# EasyEDA Pro project SP26_brainstim3_wholeCircuitSchematic(easyEDAPRO)_BenFerguson.epro

# Schematic Full Brain Stim
Board Name: Full Brain Stim; Create Date: 2026-04-13; Page Name: Sheet_1; Project Name: Brain Stim; Schematic Name: Full Brain Stim; Update Date: 2026-04-13; Add into BOM: yes; Company: Your Company; Convert to PCB: yes; Date: 2026-03-31; Draw By: bsferguson; REV: 1.0; Sheet: 1/1; spicePre: .
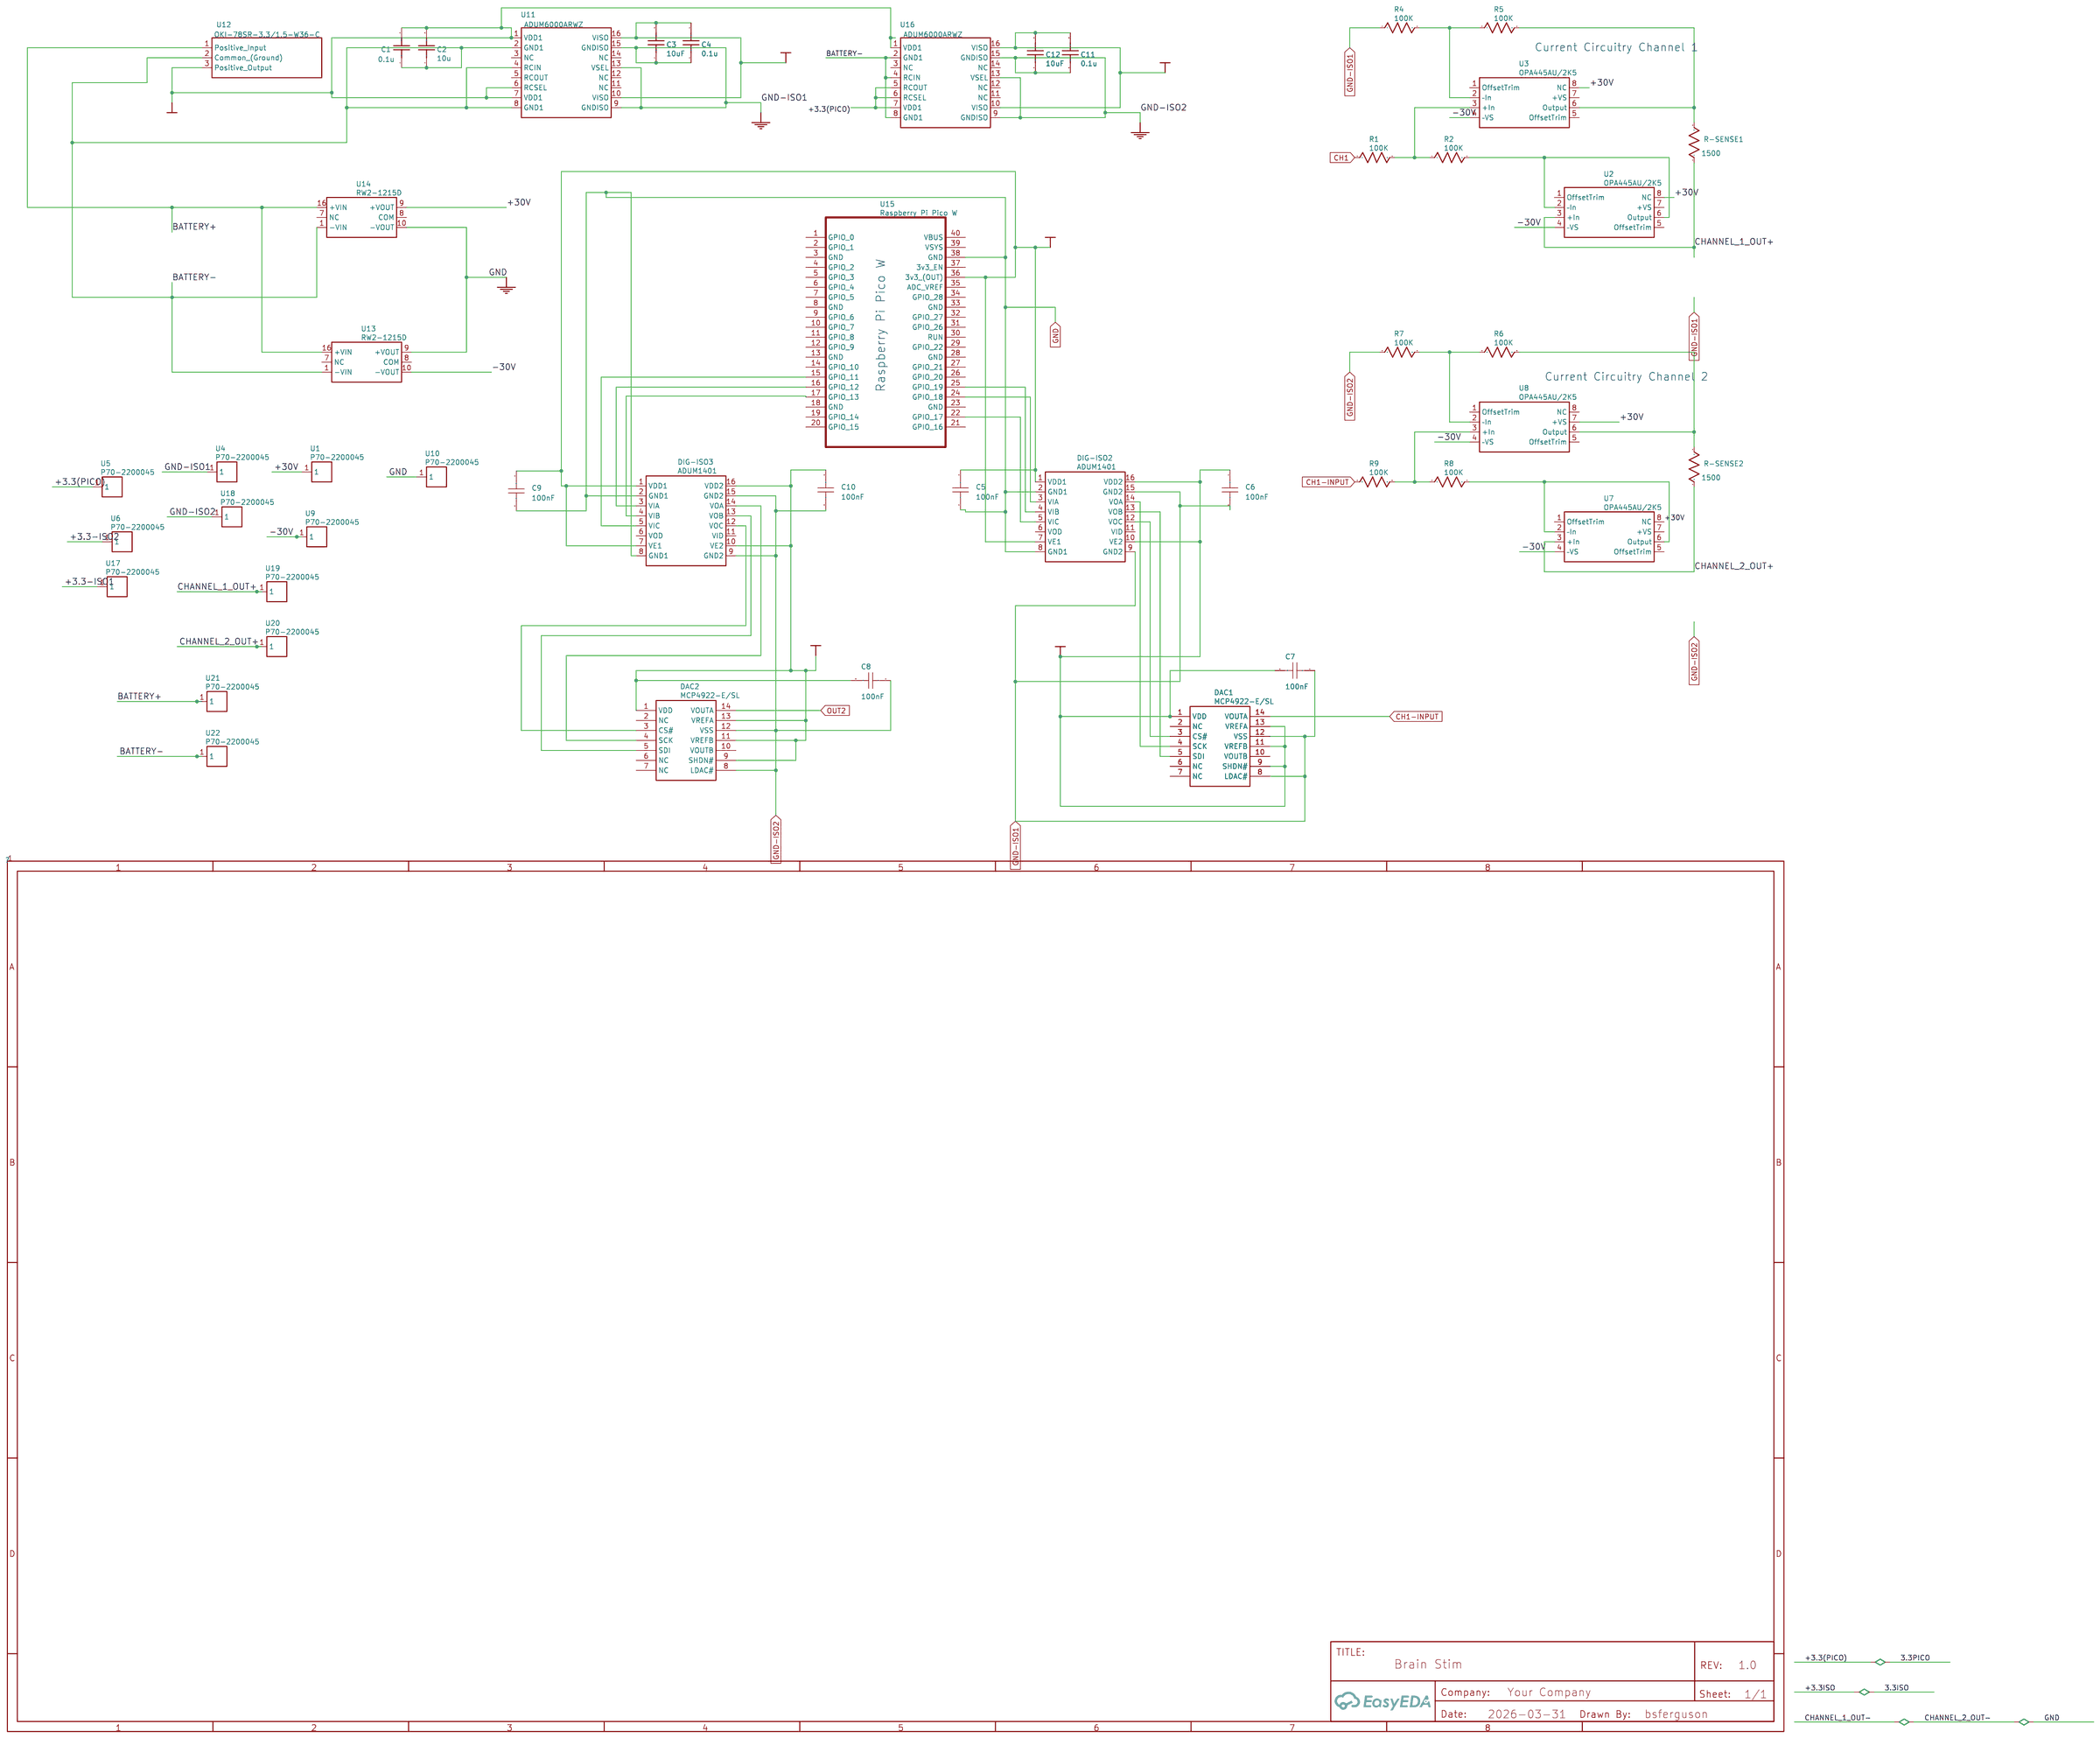
[diagram p0: schematic sheet]

## Parts
C1  0.1u  [C0603]
C2  10u  [C0603]
C3  10uF  [C0603]
C4  0.1u  [C0603]
C5  100nF  [C0603]
C6  100nF  [C0603]
C7  100nF  [C0603]
C8  100nF  [C0603]
C9  100nF  [C0603]
C10  100nF  [C0603]
C11  0.1u  [C0603]
C12  10uF  [C0603]
DAC1  MCP4922-E/SL  [SOIC-14_L8.7-W3.9-P1.27-LS6.0-BL]
DAC2  MCP4922-E/SL  [SOIC-14_L8.7-W3.9-P1.27-LS6.0-BL]
DIG-ISO2  ADUM1401  [SOIC-16_L10.3-W7.5-P1.27-LS10.3-BL]
DIG-ISO3  ADUM1401  [SOIC-16_L10.3-W7.5-P1.27-LS10.3-BL]
R1  100K  [R0603]
R2  100K  [R0603]
R4  100K  [R0603]
R5  100K  [R0603]
R6  100K  [R0603]
R7  100K  [R0603]
R8  100K  [R0603]
R9  100K  [R0603]
R-SENSE1  1500  [R0603]
R-SENSE2  1500  [R0603]
U1  P70-2200045  [TESTPOINT-TH_BD2.0-D1.0_TESTPOINT-TH_BD2.0-D1.0]
U2  OPA445AU/2K5  [SOIC-8_L4.9-W3.9-P1.27-LS6.0-BL]
U3  OPA445AU/2K5  [SOIC-8_L4.9-W3.9-P1.27-LS6.0-BL]
U4  P70-2200045  [TESTPOINT-TH_BD2.0-D1.0_TESTPOINT-TH_BD2.0-D1.0]
U5  P70-2200045  [TESTPOINT-TH_BD2.0-D1.0_TESTPOINT-TH_BD2.0-D1.0]
U6  P70-2200045  [TESTPOINT-TH_BD2.0-D1.0_TESTPOINT-TH_BD2.0-D1.0]
U7  OPA445AU/2K5  [SOIC-8_L4.9-W3.9-P1.27-LS6.0-BL]
U8  OPA445AU/2K5  [SOIC-8_L4.9-W3.9-P1.27-LS6.0-BL]
U9  P70-2200045  [TESTPOINT-TH_BD2.0-D1.0_TESTPOINT-TH_BD2.0-D1.0]
U10  P70-2200045  [TESTPOINT-TH_BD2.0-D1.0_TESTPOINT-TH_BD2.0-D1.0]
U11  ADUM6000ARWZ  [SOIC-16_L10.3-W7.4-P1.27-LS10.3-BL]
U12  OKI-78SR-3.3/1.5-W36-C  [PWRM-TH_OKI-78SR-3.3-1.5-W36-C]
U13  RW2-1215D  [PWRM-TH_RW2-XXXXX]
U14  RW2-1215D  [PWRM-TH_RW2-XXXXX]
U15  Raspberry Pi Pico W  [RASPBERRY PI PICO/ RASPBERRY PI PICO W]
U16  ADUM6000ARWZ  [SOIC-16_L10.3-W7.4-P1.27-LS10.3-BL]
U17  P70-2200045  [TESTPOINT-TH_BD2.0-D1.0_TESTPOINT-TH_BD2.0-D1.0]
U18  P70-2200045  [TESTPOINT-TH_BD2.0-D1.0_TESTPOINT-TH_BD2.0-D1.0]
U19  P70-2200045  [TESTPOINT-TH_BD2.0-D1.0_TESTPOINT-TH_BD2.0-D1.0]
U20  P70-2200045  [TESTPOINT-TH_BD2.0-D1.0_TESTPOINT-TH_BD2.0-D1.0]
U21  P70-2200045  [TESTPOINT-TH_BD2.0-D1.0_TESTPOINT-TH_BD2.0-D1.0]
U22  P70-2200045  [TESTPOINT-TH_BD2.0-D1.0_TESTPOINT-TH_BD2.0-D1.0]

## Library data of the parts
C1 C4 C11 = 0.1u: nameAlias: Value(F); Contributor: LCEDA_Lib; spicePre: C; spiceSymbolName: C_0603_US
C2 = 10u: nameAlias: Value(F); Contributor: LCEDA_Lib; spicePre: C; spiceSymbolName: C_0603_US
C3 C12 = 10uF: nameAlias: Value(F); Contributor: LCEDA_Lib; spicePre: C; spiceSymbolName: C_0603_US
C5-C10 = CAP_0603: Supplier Footprint: 0603
DAC1 DAC2 = MCP4922-E/SL: Supplier: LCSC; Manufacturer: MICROCHIP(美国微芯); Supplier Part: C39851; JLCPCB Part Class: Extended Part; Contributor: Diego Arruda da Silveira; spicePre: U
DIG-ISO2 DIG-ISO3 = ADUM1401: Supplier: LCSC; Supplier Part: C201135; Manufacturer: Analog Devices; Manufacturer Part: ADUM1401ARWZ-RL; JLCPCB Part Class: Extend; Contributor: inenarokomov; LCSC Assembly: Yes; spicePre: U; spiceSymbolName: ADUM1401ARWZ-RL
R1 R2 R4-R9 = 100K: nameAlias: Value(Ω); Contributor: LCEDA_Lib; spicePre: R; spiceSymbolName: R_0603_US
R-SENSE1 R-SENSE2 = 1500: nameAlias: Value(Ω); Contributor: LCEDA_Lib; spicePre: R; spiceSymbolName: R_0603_US
U1 U4-U6 U9 U10 U17-U22 = P70-2200045: Supplier: LCSC; Supplier Part: C21890164; Manufacturer: Harwin; JLCPCB Part Class: Extended Part; Contributor: lcsc; spicePre: U
U2 U3 U7 U8 = OPA445AU/2K5: Supplier: LCSC; Supplier Part: C1348606; Manufacturer: TI(德州仪器); JLCPCB Part Class: Extended Part; Contributor: LCSC; spicePre: U
U11 U16 = ADUM6000ARWZ: Supplier: LCSC; Supplier Part: C661383; Manufacturer: ADI(亚德诺); JLCPCB Part Class: Extended Part; Contributor: LCSC; spicePre: U
U12 = OKI-78SR-3.3/1.5-W36-C: Supplier: LCSC; Supplier Part: C9900205302; Manufacturer: null; Contributor: lcsc; spicePre: U
U13 U14 = RW2-1215D: Supplier: LCSC; Supplier Part: C6208624; Manufacturer: Recom Power; JLCPCB Part Class: Extended Part; Contributor: lcsc; spicePre: U
U15 = Raspberry Pi Pico W: Manufacturer: Raspberry Pi; Manufacturer Part: PICO W; Supplier Part: C7203003; Supplier: LCSC; Contributor: lynxaniya; spicePre: U

## Nets
+3.3V-ISO1: C6.1 C7.2 DAC1.1(VDD) DAC1.9(SHDN#) DAC1.11(VREFB) DAC1.13(VREFA) DIG-ISO2.10(VE2) DIG-ISO2.16(VDD2)
+30V: U1.1 U2.8(NC) U3.8(NC) U7.8(NC) U8.7(+VS) U14.9(+VOUT)
-30V: U2.4(–VS) U3.4(–VS) U7.4(–VS) U8.4(–VS) U9.1 U13.10(-VOUT)
GND: C5.2 C9.2 DIG-ISO2.2(GND1) DIG-ISO2.8(GND1) DIG-ISO3.2(GND1) DIG-ISO3.8(GND1) U10.1 U13.9(+VOUT) U14.10(-VOUT) U15.38(GND)
GND-ISO1: C3.1 C4.1 C6.2 C7.1 DAC1.8(LDAC#) DAC1.12(VSS) DIG-ISO2.9(GND2) DIG-ISO2.15(GND2) R4.1 U4.1 U11.9(GNDISO) U11.13(VSEL) U11.15(GNDISO)
GND-ISO2: C8.1 C10.2 C11.1 C12.1 DAC2.8(LDAC#) DAC2.12(VSS) DIG-ISO3.9(GND2) DIG-ISO3.15(GND2) R7.1 U16.9(GNDISO) U16.13(VSEL) U16.15(GNDISO) U18.1
+3.3(PICO): C1.2 C2.2 C5.1 C9.1 DIG-ISO2.1(VDD1) DIG-ISO2.7(VE1) DIG-ISO3.1(VDD1) DIG-ISO3.7(VE1) U5.1 U11.1(VDD1) U11.6(RCSEL) U11.7(VDD1) U12.3(Positive Output) U15.36(3v3 (OUT)) U16.1(VDD1) U16.5(RCOUT) U16.6(RCSEL) U16.7(VDD1)
+3.3-ISO1: C3.2 C4.2 U11.10(VISO) U11.16(VISO) U17.1
+3.3-ISO2: C11.2 C12.2 U6.1 U16.10(VISO) U16.16(VISO)
BATTERY+: U12.1(Positive Input) U13.16(+VIN) U14.16(+VIN) U21.1
BATTERY-: C1.1 C2.1 U11.2(GND1) U11.4(RCIN) U11.8(GND1) U12.2(Common (Ground)) U13.1(-VIN) U14.1(-VIN) U16.2(GND1) U16.4(RCIN) U16.8(GND1) U22.1
CH1: R1.1
CH1-INPUT: DAC1.14(VOUTA) R9.1
CHANNEL_1_OUT+: R-SENSE1.1 U2.3(+In) U19.1
CHANNEL_2_OUT+: R-SENSE2.1 U7.3(+In) U20.1
OUT2: DAC2.14(VOUTA)
$1N1: R1.2 R2.1 U3.3(+In)
$1N2: R2.2 U2.2(–In) U2.6(Output)
$1N5: R4.2 R5.1 U3.2(–In)
$1N7: R5.2 R-SENSE1.2 U3.6(Output)
$1N9: R6.2 R-SENSE2.2 U8.6(Output)
$1N11: R6.1 R7.2 U8.2(–In)
$1N13: R8.2 U7.2(–In) U7.6(Output)
$1N14: R8.1 R9.2 U8.3(+In)
$1N1782: DAC1.5(SDI) DIG-ISO2.13(VOB)
$1N1783: DIG-ISO2.4(VIB) U15.25(GPIO 19)
$1N1784: DAC1.4(SCK) DIG-ISO2.14(VOA)
$1N1785: DIG-ISO2.3(VIA) U15.24(GPIO 18)
$1N1786: DAC1.3(CS#) DIG-ISO2.12(VOC)
$1N1787: DIG-ISO2.5(VIC) U15.22(GPIO 17)
$1N1790: DIG-ISO3.3(VIA) U15.16(GPIO 12)
$1N1791: DIG-ISO3.4(VIB) U15.17(GPIO 13)
$1N1792: DAC2.4(SCK) DIG-ISO3.14(VOA)
$1N1793: DAC2.5(SDI) DIG-ISO3.13(VOB)
$1N1794: DAC2.3(CS#) DIG-ISO3.12(VOC)
$1N1795: DIG-ISO3.5(VIC) U15.15(GPIO 11)
$1N1797: C8.2 C10.1 DAC2.1(VDD) DAC2.9(SHDN#) DAC2.11(VREFB) DAC2.13(VREFA) DIG-ISO3.10(VE2) DIG-ISO3.16(VDD2)

Not connected (* = marked no-connect by the designer): DAC1 2(NC) 6(NC) 7(NC) 10(VOUTB); DAC2 2(NC) 6(NC) 7(NC) 10(VOUTB); DIG-ISO2 6(VOD) 11(VID); DIG-ISO3 6(VOD) 11(VID); U2 1(OffsetTrim) 5(OffsetTrim) 7(+VS); U3 1(OffsetTrim) 5(OffsetTrim) 7(+VS); U7 1(OffsetTrim) 5(OffsetTrim) 7(+VS); U8 1(OffsetTrim) 5(OffsetTrim) 8(NC); U11 3(NC) 5(RCOUT) 11(NC) 12(NC) 14(NC); U13 7(NC) 8(COM); U14 7(NC) 8(COM); U15 1(GPIO 0) 2(GPIO 1) 3(GND) 4(GPIO 2) 5(GPIO 3) 6(GPIO 4) 7(GPIO 5) 8(GND) 9(GPIO 6) 10(GPIO 7) 11(GPIO 8) 12(GPIO 9) 13(GND) 14(GPIO 10) 18(GND) 19(GPIO 14) 20(GPIO 15) 21(GPIO 16) 23(GND) 26(GPIO 20) 27(GPIO 21) 28(GND) 29(GPIO 22) 30(RUN) 31(GPIO 26) 32(GPIO 27) 33(GND) 34(GPIO 28) 35(ADC_VREF) 37(3v3_EN) 39(VSYS) 40(VBUS); U16 3(NC) 11(NC) 12(NC) 14(NC)

## Notes on the sheet
- Current Circuitry Channel 1
- Raspberry Pi Pico W
- Current Circuitry Channel 2

# Schematic sig gen
Board Name: sig gen; Create Date: 2026-04-07; Page Name: Sheet_1; Project Name: BackupProjects_jacksonmertes_personal_0_20260327; Schematic Name: sig gen; Update Date: 2026-04-11; Add into BOM: yes; Company: Your Company; Convert to PCB: yes; Date: 2026-03-18; Draw By: jacksonmertes; REV: 1.0; Sheet: 1/1; spicePre: .
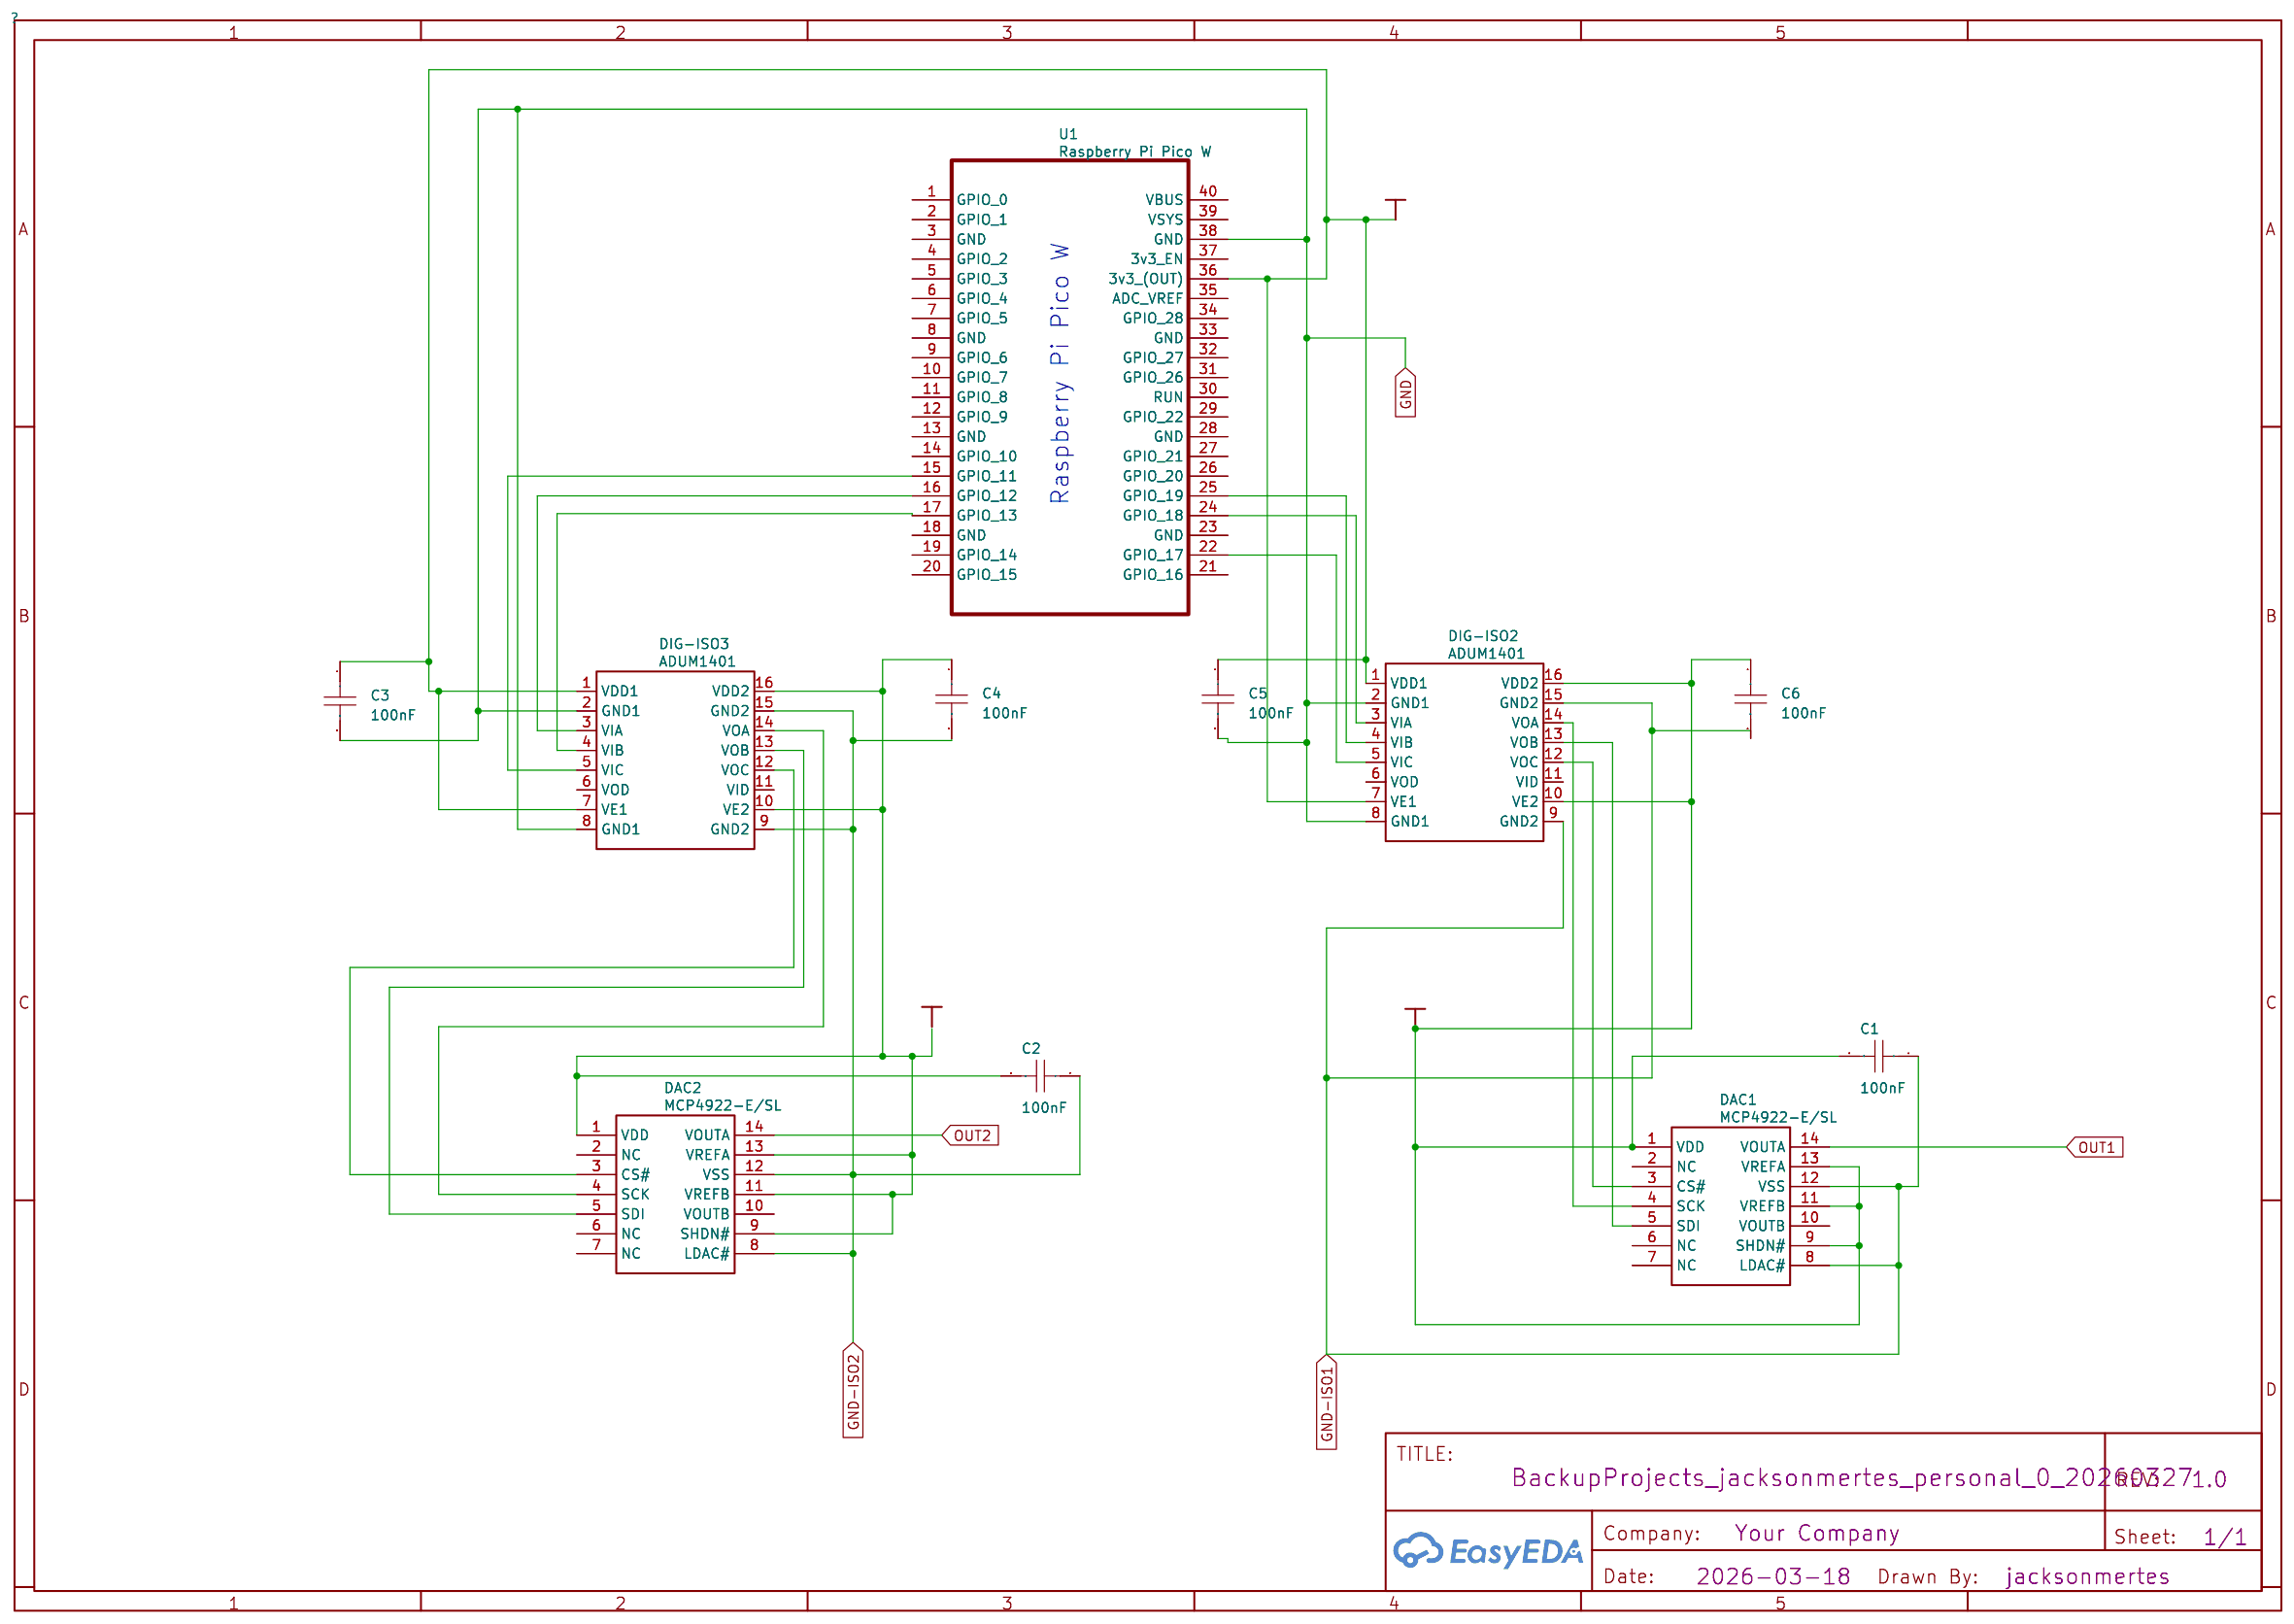
[diagram p1: schematic sheet]

## Parts
C1  100nF  [C0603]
C2  100nF  [C0603]
C3  100nF  [C0603]
C4  100nF  [C0603]
C5  100nF  [C0603]
C6  100nF  [C0603]
DAC1  MCP4922-E/SL  [SOIC-14_L8.7-W3.9-P1.27-LS6.0-BL]
DAC2  MCP4922-E/SL  [SOIC-14_L8.7-W3.9-P1.27-LS6.0-BL]
DIG-ISO2  ADUM1401  [SOIC-16_L10.3-W7.5-P1.27-LS10.3-BL]
DIG-ISO3  ADUM1401  [SOIC-16_L10.3-W7.5-P1.27-LS10.3-BL]
U1  Raspberry Pi Pico W  [RASPBERRY PI PICO/ RASPBERRY PI PICO W]

## Library data of the parts
C1-C6 = CAP_0603: Supplier Footprint: 0603
DAC1 DAC2 = MCP4922-E/SL: Supplier: LCSC; Manufacturer: MICROCHIP(美国微芯); Supplier Part: C39851; JLCPCB Part Class: Extended Part; Contributor: Diego Arruda da Silveira; spicePre: U
DIG-ISO2 DIG-ISO3 = ADUM1401: Supplier: LCSC; Supplier Part: C201135; Manufacturer: Analog Devices; Manufacturer Part: ADUM1401ARWZ-RL; JLCPCB Part Class: Extend; Contributor: inenarokomov; LCSC Assembly: Yes; spicePre: U; spiceSymbolName: ADUM1401ARWZ-RL
U1 = Raspberry Pi Pico W: Manufacturer: Raspberry Pi; Manufacturer Part: PICO W; Supplier Part: C7203003; Supplier: LCSC; Contributor: lynxaniya; spicePre: U

## Nets
+3.3V: C3.1 C5.1 DIG-ISO2.1(VDD1) DIG-ISO2.7(VE1) DIG-ISO3.1(VDD1) DIG-ISO3.7(VE1) U1.36(3v3 (OUT))
+3.3V-ISO1: C1.2 C6.1 DAC1.1(VDD) DAC1.9(SHDN#) DAC1.11(VREFB) DAC1.13(VREFA) DIG-ISO2.10(VE2) DIG-ISO2.16(VDD2)
GND: C3.2 C5.2 DIG-ISO2.2(GND1) DIG-ISO2.8(GND1) DIG-ISO3.2(GND1) DIG-ISO3.8(GND1) U1.38(GND)
GND-ISO1: C1.1 C6.2 DAC1.8(LDAC#) DAC1.12(VSS) DIG-ISO2.9(GND2) DIG-ISO2.15(GND2)
GND-ISO2: C2.1 C4.2 DAC2.8(LDAC#) DAC2.12(VSS) DIG-ISO3.9(GND2) DIG-ISO3.15(GND2)
OUT1: DAC1.14(VOUTA)
OUT2: DAC2.14(VOUTA)
DAC1_3: DAC1.3(CS#) DIG-ISO2.12(VOC)
DAC1_4: DAC1.4(SCK) DIG-ISO2.14(VOA)
DAC1_5: DAC1.5(SDI) DIG-ISO2.13(VOB)
DIG-ISO2_3: DIG-ISO2.3(VIA) U1.24(GPIO 18)
DIG-ISO2_4: DIG-ISO2.4(VIB) U1.25(GPIO 19)
DIG-ISO2_5: DIG-ISO2.5(VIC) U1.22(GPIO 17)
Net-(C2-2): C2.2 C4.1 DAC2.1(VDD) DAC2.9(SHDN#) DAC2.11(VREFB) DAC2.13(VREFA) DIG-ISO3.10(VE2) DIG-ISO3.16(VDD2)
Net-(DAC2-3): DAC2.3(CS#) DIG-ISO3.12(VOC)
Net-(DAC2-4): DAC2.4(SCK) DIG-ISO3.14(VOA)
Net-(DAC2-5): DAC2.5(SDI) DIG-ISO3.13(VOB)
Net-(DIG-ISO3-3): DIG-ISO3.3(VIA) U1.16(GPIO 12)
Net-(DIG-ISO3-4): DIG-ISO3.4(VIB) U1.17(GPIO 13)
Net-(DIG-ISO3-5): DIG-ISO3.5(VIC) U1.15(GPIO 11)

Not connected (* = marked no-connect by the designer): DAC1 2(NC) 6(NC) 7(NC) 10(VOUTB); DAC2 2(NC) 6(NC) 7(NC) 10(VOUTB); DIG-ISO2 6(VOD) 11(VID); DIG-ISO3 6(VOD) 11(VID); U1 1(GPIO 0) 2(GPIO 1) 3(GND) 4(GPIO 2) 5(GPIO 3) 6(GPIO 4) 7(GPIO 5) 8(GND) 9(GPIO 6) 10(GPIO 7) 11(GPIO 8) 12(GPIO 9) 13(GND) 14(GPIO 10) 18(GND) 19(GPIO 14) 20(GPIO 15) 21(GPIO 16) 23(GND) 26(GPIO 20) 27(GPIO 21) 28(GND) 29(GPIO 22) 30(RUN) 31(GPIO 26) 32(GPIO 27) 33(GND) 34(GPIO 28) 35(ADC_VREF) 37(3v3_EN) 39(VSYS) 40(VBUS)

## Notes on the sheet
- Raspberry Pi Pico W

# Board 1-PCB_PCB_sig gen
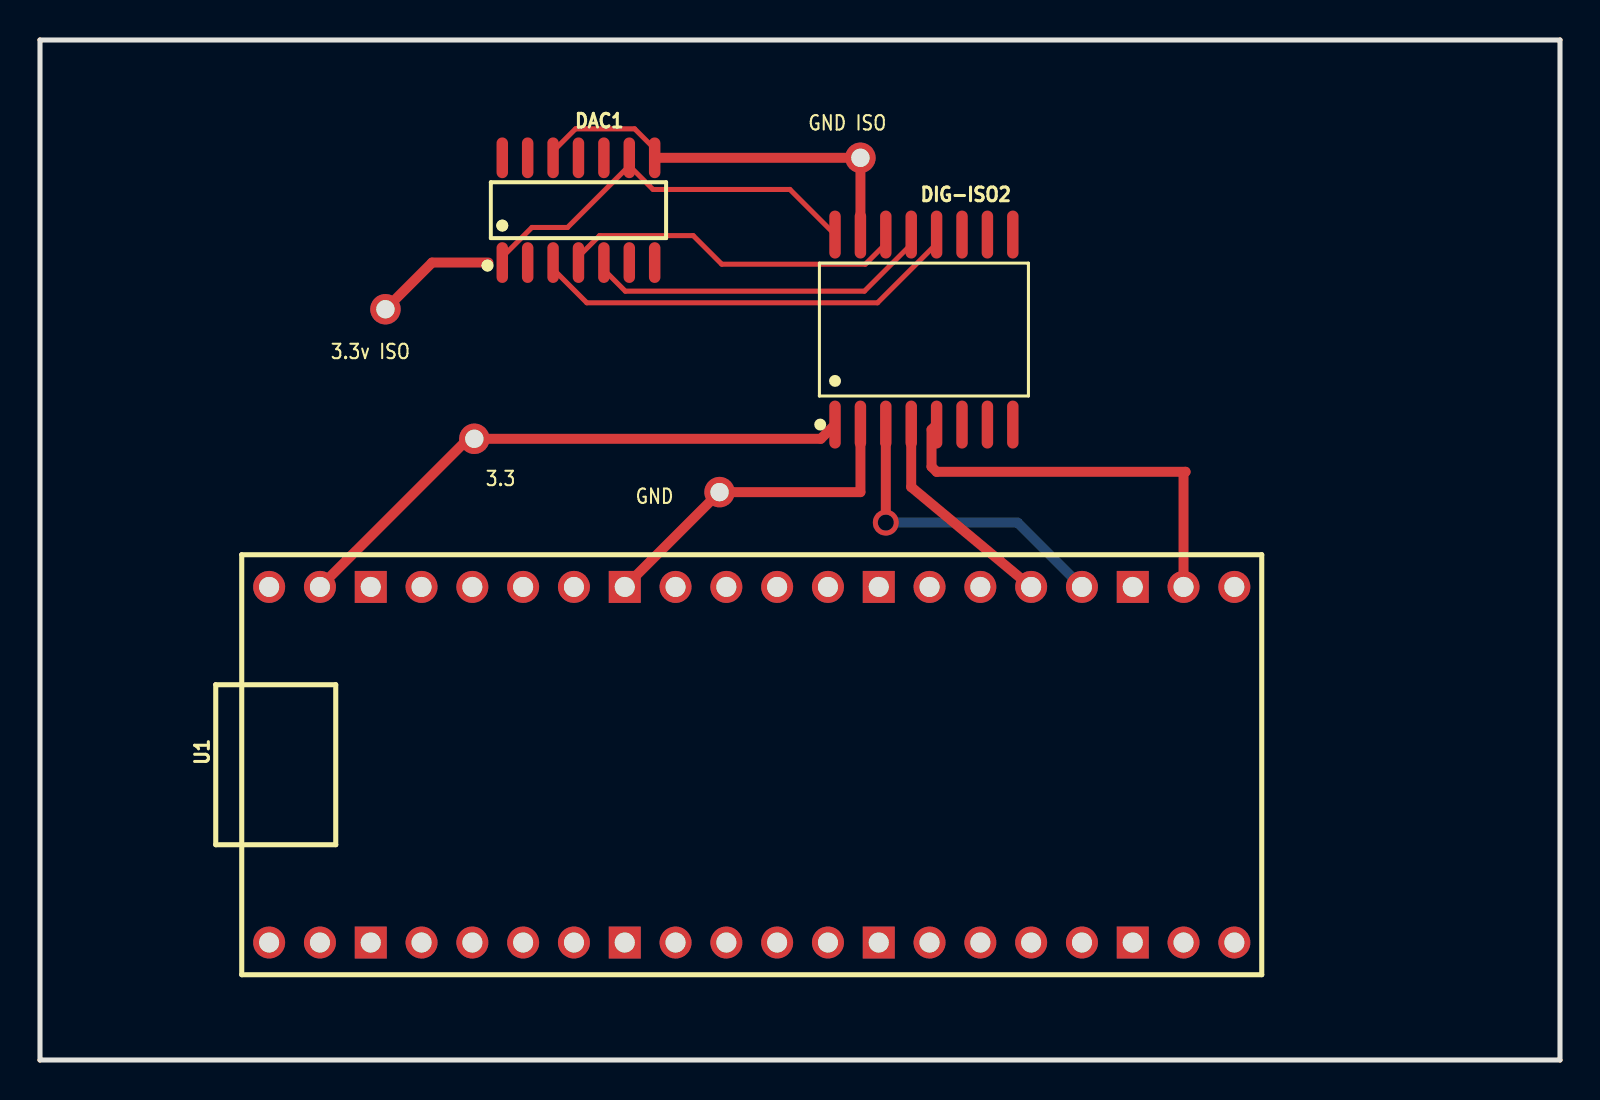
[diagram p2: board, top side]
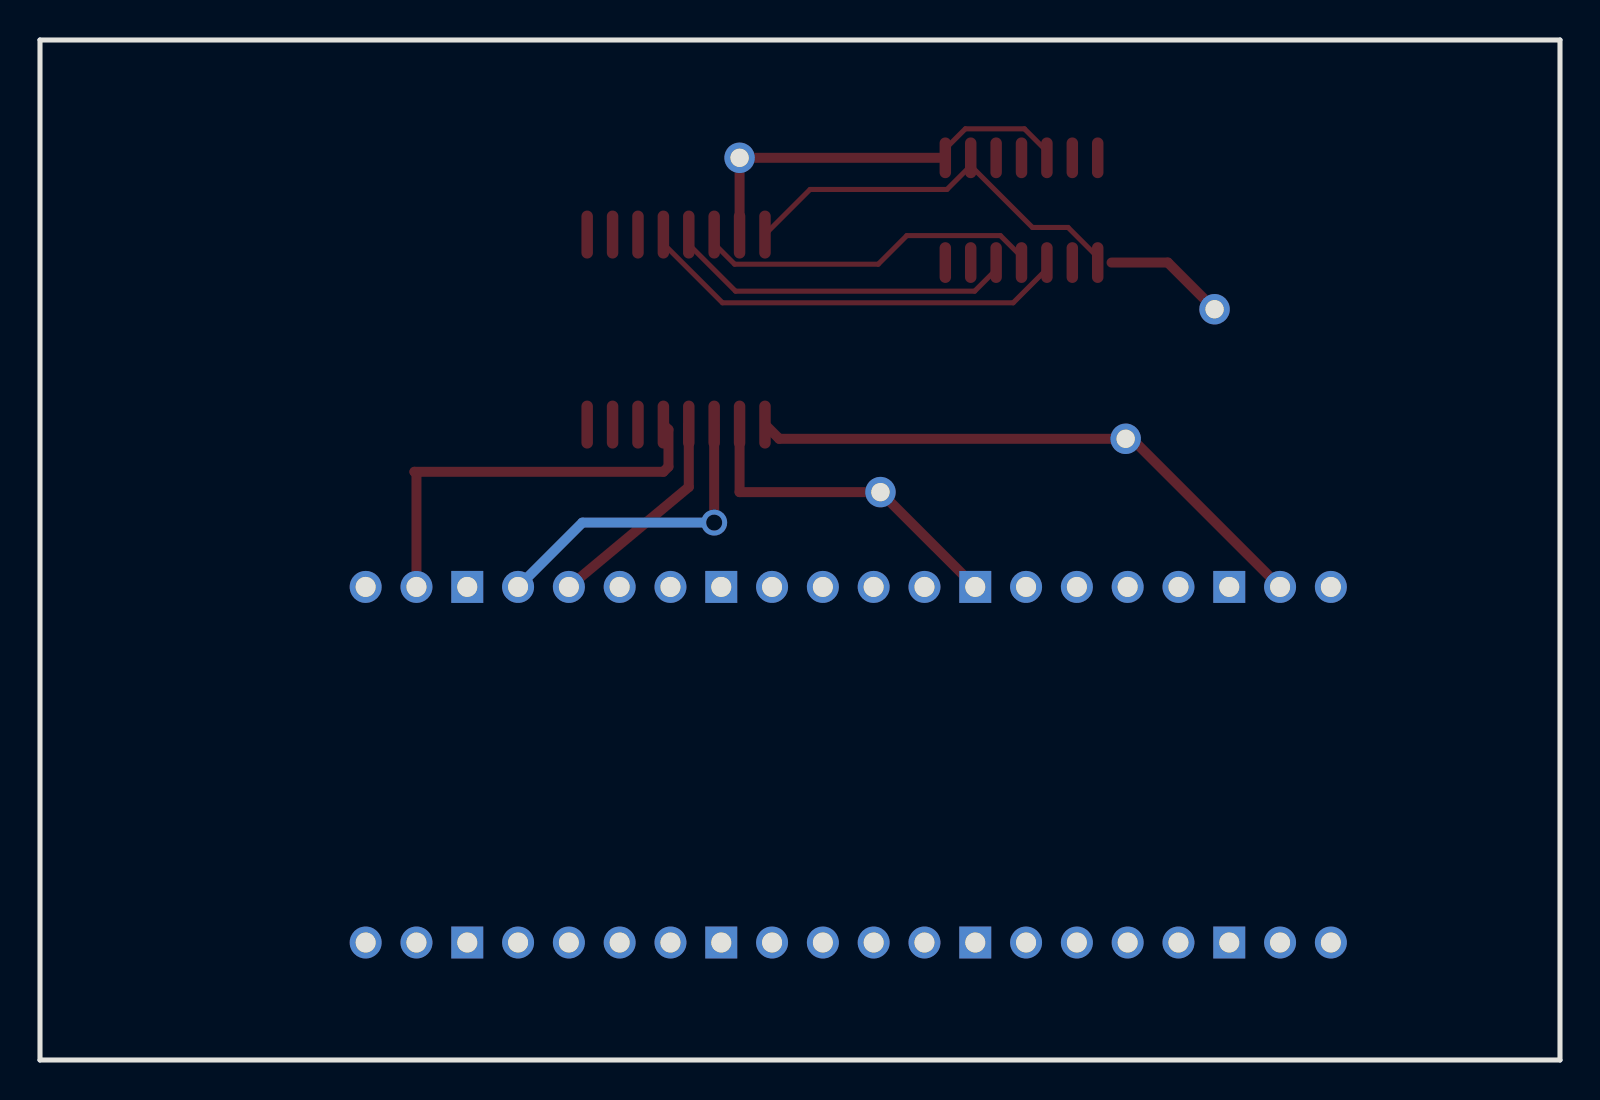
[diagram p3: board, bottom side, seen from below]

Outline 76 x 51 mm; copper layers: Top Layer, Bottom Layer. Coordinates in mm from the lower left corner of the outline.
Outline path: 0,51 76,51 76,0 0,0 0,51

## Design rules (mm)
via Default (default): diameter min 0.61, default 0.61, max 100.025; hole min 0.305, default 0.305, max 59.995

## Placement (name value [footprint] x y rotation side)
DAC1  MCP4922-E/SL  [SOIC-14_L8.7-W3.9-P1.27-LS6.0-BL]  26.92 42.49 0 top
DIG-ISO2  ADUM1401  [SOIC-16_L10.3-W7.5-P1.27-LS10.3-BL]  44.2 36.52 0 top
NOREF  -  [Pad_e93]  33.98 28.39 0 top
NOREF#2  -  [Pad_e94]  41.02 45.11 0 top
NOREF#3  -  [Pad_e91]  21.72 31.06 0 top
NOREF#4  -  [Pad_e92]  17.27 37.54 0 top
U1  Raspberry Pi Pico W  [RASPBERRY PI PICO/ RASPBERRY PI PICO W]  61.09 4.26 90 top

## Footprints (pads in the part's own frame, mm; a bottom-side part is the same pattern mirrored in y, then rotated)
Pad_e91
  round 1.524 hole 0.914: 2(0,0)
Pad_e92
  round 1.524 hole 0.914: 3(0,0)
Pad_e93
  round 1.524 hole 0.914: 6(0,0)
Pad_e94
  round 1.524 hole 0.914: 7(0,0)
RASPBERRY PI PICO/ RASPBERRY PI PICO W
  round 1.6 hole 1: 1(1.61,49.63) 2(1.61,47.09) 4(1.61,42.01) 5(1.61,39.47) 6(1.61,36.93) 7(1.61,34.39) 9(1.61,29.31) 10(1.61,26.77) 11(1.61,24.23) 12(1.61,21.69) 14(1.61,16.61) 15(1.61,14.07) 16(1.61,11.53) 17(1.61,8.99) 19(1.61,3.91) 20(1.61,1.37) 21(19.39,1.37) 22(19.39,3.91) 24(19.39,8.99) 25(19.39,11.53) 26(19.39,14.07) 27(19.39,16.61) 29(19.39,21.69) 30(19.39,24.23) 31(19.39,26.77) 32(19.39,29.31) 34(19.39,34.39) 35(19.39,36.93) 36(19.39,39.47) 37(19.39,42.01) 39(19.39,47.09) 40(19.39,49.63)
  rect 1.6x1.6 hole 1: 3(1.61,44.55) 8(1.61,31.85) 13(1.61,19.15) 18(1.61,6.45) 23(19.39,6.45) 28(19.39,19.15) 33(19.39,31.85) 38(19.39,44.55)
SOIC-14_L8.7-W3.9-P1.27-LS6.0-BL
  oval 0.574x2.038 smd: 1(-3.81,-2.619) 2(-2.54,-2.619) 3(-1.27,-2.619) 4(0,-2.619) 5(1.27,-2.619) 6(2.54,-2.619) 7(3.81,-2.619) 8(3.81,2.619) 9(2.54,2.619) 10(1.27,2.619) 11(0,2.619) 12(-1.27,2.619) 13(-2.54,2.619) 14(-3.81,2.619)
SOIC-16_L10.3-W7.5-P1.27-LS10.3-BL
  oval 0.574x2.401 smd: 1(-4.445,-4.75) 2(-3.175,-4.75) 3(-1.905,-4.75) 4(-0.635,-4.75) 5(0.635,-4.75) 6(1.905,-4.75) 7(3.175,-4.75) 8(4.445,-4.75) 9(4.445,4.75) 10(3.175,4.75) 11(1.905,4.75) 12(0.635,4.75) 13(-0.635,4.75) 14(-1.905,4.75) 15(-3.175,4.75) 16(-4.445,4.75)

## Nets
As in the schematic, except:
+3.3V: DIG-ISO2.1 NOREF#3.2 U1.39
+3.3V-ISO: DAC1.1 DAC1.9 DIG-ISO2.16
GND: DIG-ISO2.2 NOREF.6 U1.33
GND-ISO: DAC1.8 DAC1.12 DIG-ISO2.15 NOREF#2.7

## Via types
v1: diameter 1.3, hole 0.8, Top Layer to Bottom Layer, 1 via

## Routing (per net, layer and track width the routed paths; a pad name or vN(x,y) marks a point on that pad's centre or on a via; arc(x,y) is an arc through that point)
+3.3V: length 29.1
  Top Layer w0.5: DIG-ISO2.1 39.04,31.06 NOREF#3.2 21.4,31.06 U1.39
+3.3V-ISO: length 20.6
  Top Layer w0.254: DAC1.1 23.11,40.14 24.6,41.63 26.38,41.63 29.46,44.71 ; DIG-ISO2.16 37.5,43.53 30.65,43.53 29.46,44.71 ; 29.46,44.71 DAC1.9
GND: length 17.1
  Top Layer w0.5: DIG-ISO2.2 41.02,28.39 NOREF.6 U1.33
GND-ISO: length 20.9
  Top Layer w0.254: DAC1.8 30.73,45.56 29.73,46.56 26.78,46.56 25.65,45.44 DAC1.12
  Top Layer w0.5: DAC1.8 NOREF#2.7 DIG-ISO2.15
DAC1_3: length 21.9
  Top Layer w0.254: DAC1.3 25.65,39.55 27.34,37.86 41.88,37.86 44.83,40.82 DIG-ISO2.12
DAC1_4: length 17.6
  Top Layer w0.254: DAC1.4 26.92,40.16 27.98,41.22 32.66,41.22 34.09,39.79 41.27,39.79 42.29,40.81 DIG-ISO2.14
DAC1_5: length 17.6
  Top Layer w0.254: DIG-ISO2.13 43.56,40.78 41.22,38.44 29.27,38.44 28.19,39.51 DAC1.5
DIG-ISO2_3: length 16
  Top Layer w0.5: v1(42.29,26.87) DIG-ISO2.3
  Bottom Layer w0.5: v1(42.29,26.87) 48.88,26.87 U1.24
DIG-ISO2_4: length 10.9
  Top Layer w0.5: DIG-ISO2.4 43.56,28.65 U1.25
DIG-ISO2_5: length 20.8
  Top Layer w0.5: DIG-ISO2.5 44.58,31.52 44.58,29.66 44.83,29.41 57.28,29.41 57.18,29.31 U1.22
S$2519: length 6.1
  Top Layer w0.5: 22.42,39.87 19.61,39.87 NOREF#4.3

## Text on the board
Top Silkscreen Layer: 3.3v ISO | 3.3 | GND | GND ISO

# Board PCB5
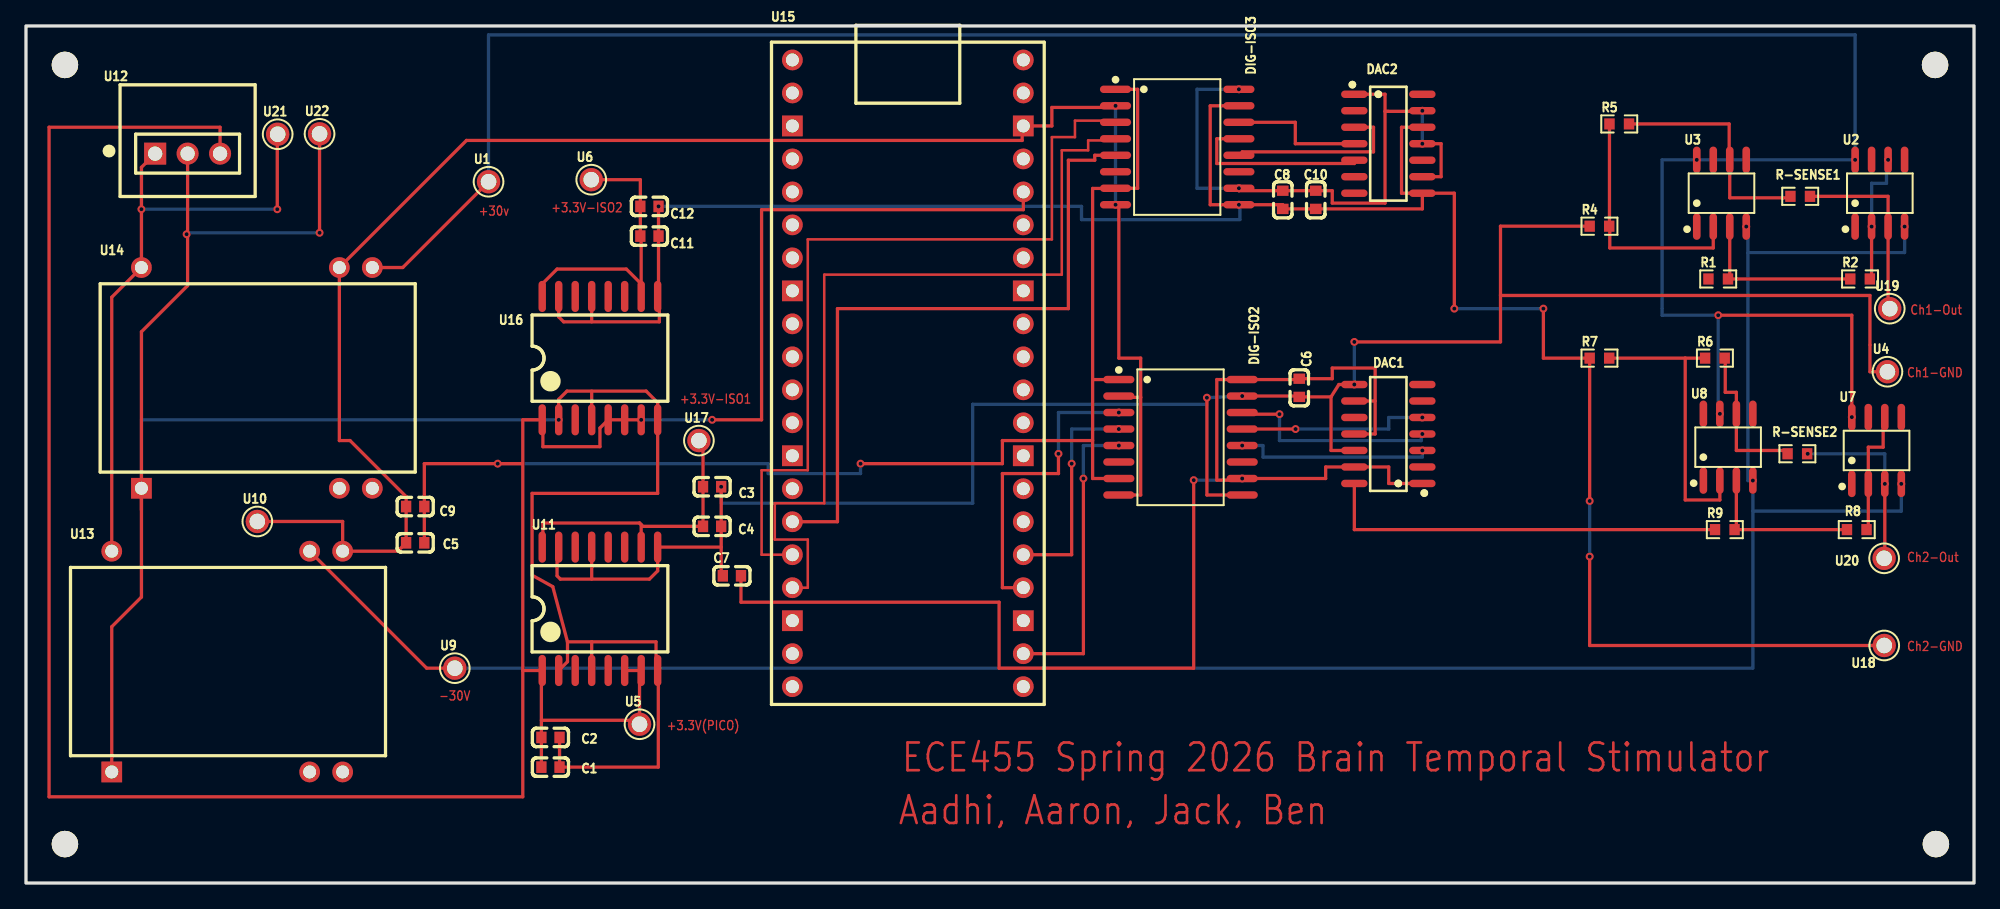
[diagram p4: board, top side]
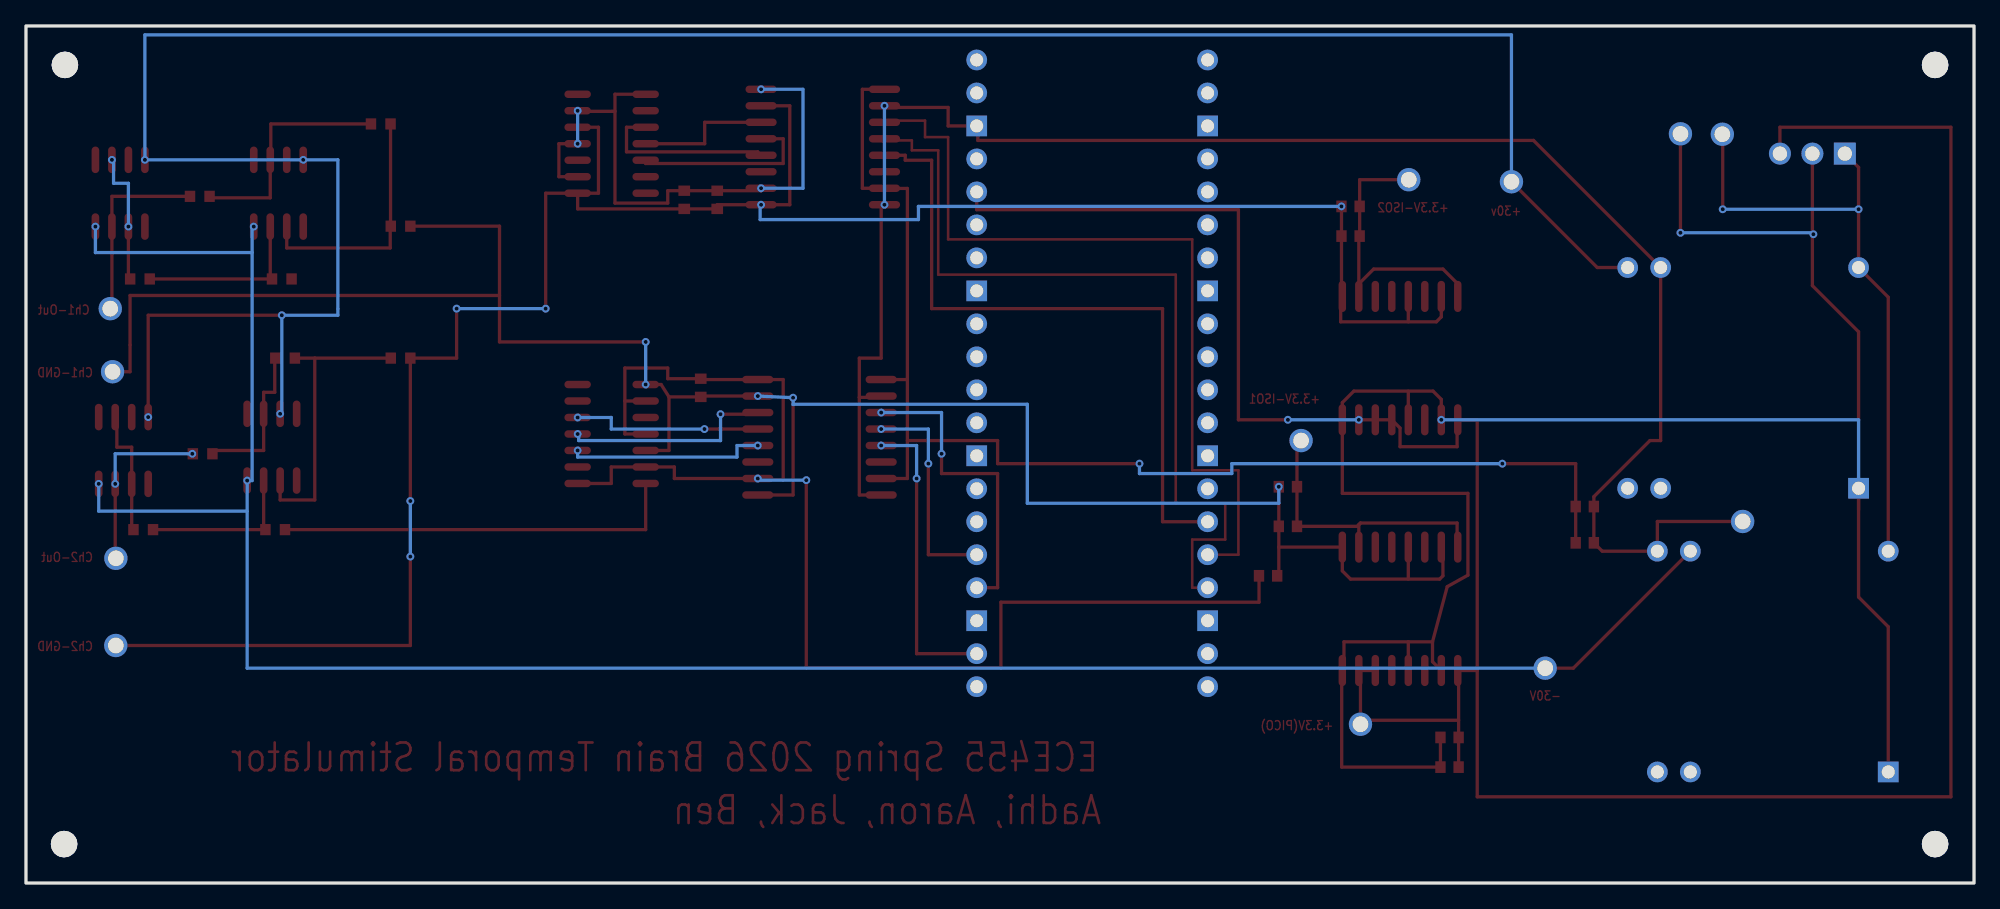
[diagram p5: board, bottom side, seen from below]

Outline 150 x 66 mm; copper layers: Top Layer, Bottom Layer. Coordinates in mm from the lower left corner of the outline.
Outline path: rectangle 0,66 150,0
Stack: Top Layer 0.035mm / Dielectric1 1.51mm FR4 er 4.5 / Bottom Layer 0.035mm

## Design rules (mm)
template: JLCPCB Capability(Two Layers Board)
spacing copperThickness1oz (default): track to track 0.102, other pairs 0.152 to 0.3
spacing copperThickness2oz: track to track 0.203, other pairs 0.152 to 0.3
track width copperThickness1oz (default): min 0.127, default 0.254, max 2.54
track width copperThickness2oz: min 0.203, default 0.254, max 2.54
differential pair differentialPair (default): width min 0.127, default 0.254, max 2.54; gap min 0.152, default 0.152
via viaSize (default): diameter min 0.5, default 0.61, max 10; hole min 0.3, default 0.305, max 6.3

## Placement (name value [footprint] x y rotation side)
C1  0.1u  [C0603]  40.39 8.93 180 top
C2  10u  [C0603]  40.39 11.21 180 top
C3  10uF  [C0603]  52.83 30.52 180 top
C4  0.1u  [C0603]  52.83 27.47 180 top
C5  100nF  [C0603]  29.97 26.2 180 top
C6  100nF  [C0603]  98.04 38.14 270 top
C7  100nF  [C0603]  54.36 23.66 0 top
C8  100nF  [C0603]  96.77 52.61 90 top
C9  100nF  [C0603]  29.97 28.99 180 top
C10  100nF  [C0603]  99.31 52.61 270 top
C11  0.1u  [C0603]  48.01 49.82 180 top
C12  10uF  [C0603]  48.01 52.11 180 top
DAC1  MCP4922-E/SL  [SOIC-14_L8.7-W3.9-P1.27-LS6.0-BL]  104.9 34.58 90 top
DAC2  MCP4922-E/SL  [SOIC-14_L8.7-W3.9-P1.27-LS6.0-BL]  104.9 56.93 270 top
DIG-ISO2  ADUM1401  [SOIC-16_L10.3-W7.5-P1.27-LS10.3-BL]  88.9 34.33 270 top
DIG-ISO3  ADUM1401  [SOIC-16_L10.3-W7.5-P1.27-LS10.3-BL]  88.65 56.68 270 top
NOREF  -  [Pad_e47]  3 63 0 top
NOREF#2  -  [Pad_e51]  147 63 0 top
NOREF#3  -  [Pad_e53]  3 3 0 top
NOREF#4  -  [Pad_e56]  147.07 3 0 top
R1  100K  [R0603]  130.3 46.52 0 top
R2  100K  [R0603]  141.22 46.52 0 top
R4  100K  [R0603]  121.16 50.58 0 top
R5  100K  [R0603]  122.68 58.46 0 top
R6  100K  [R0603]  130.05 40.42 0 top
R7  100K  [R0603]  121.16 40.42 0 top
R8  100K  [R0603]  140.97 27.21 0 top
R9  100K  [R0603]  130.81 27.21 0 top
R-SENSE1  1500  [R0603]  136.62 52.88 180 top
R-SENSE2  1500  [R0603]  136.4 33.06 180 top
U1  P70-2200045  [TESTPOINT-TH_BD2.0-D1.0_TESTPOINT-TH_BD2.0-D1.0]  35.62 54 0 top
U2  OPA445AU/2K5  [SOIC-8_L4.9-W3.9-P1.27-LS6.0-BL]  142.75 53.12 0 top
U3  OPA445AU/2K5  [SOIC-8_L4.9-W3.9-P1.27-LS6.0-BL]  130.56 53.12 0 top
U4  P70-2200045  [TESTPOINT-TH_BD2.0-D1.0_TESTPOINT-TH_BD2.0-D1.0]  143.33 39.37 0 top
U5  P70-2200045  [TESTPOINT-TH_BD2.0-D1.0_TESTPOINT-TH_BD2.0-D1.0]  47.24 12.23 0 top
U6  P70-2200045  [TESTPOINT-TH_BD2.0-D1.0_TESTPOINT-TH_BD2.0-D1.0]  43.53 54.16 0 top
U7  OPA445AU/2K5  [SOIC-8_L4.9-W3.9-P1.27-LS6.0-BL]  142.49 33.31 0 top
U8  OPA445AU/2K5  [SOIC-8_L4.9-W3.9-P1.27-LS6.0-BL]  131.06 33.56 0 top
U9  P70-2200045  [TESTPOINT-TH_BD2.0-D1.0_TESTPOINT-TH_BD2.0-D1.0]  33.02 16.55 0 top
U10  P70-2200045  [TESTPOINT-TH_BD2.0-D1.0_TESTPOINT-TH_BD2.0-D1.0]  17.82 27.84 0 top
U11  ADUM6000ARWZ  [SOIC-16_L10.3-W7.4-P1.27-LS10.3-BL]  44.2 21.12 0 top
U12  OKI-78SR-3.3/1.5-W36-C  [PWRM-TH_OKI-78SR-3.3-1.5-W36-C]  12.45 56.17 0 top
U13  RW2-1215D  [PWRM-TH_RW2-XXXXX]  15.49 17.05 0 top
U14  RW2-1215D  [PWRM-TH_RW2-XXXXX]  17.78 38.9 0 top
U15  Raspberry Pi Pico W  [RASPBERRY PI PICO/ RASPBERRY PI PICO W]  57.4 13.75 0 top
U16  ADUM6000ARWZ  [SOIC-16_L10.3-W7.4-P1.27-LS10.3-BL]  44.2 40.42 0 top
U17  P70-2200045  [TESTPOINT-TH_BD2.0-D1.0_TESTPOINT-TH_BD2.0-D1.0]  51.82 34.07 0 top
U18  P70-2200045  [TESTPOINT-TH_BD2.0-D1.0_TESTPOINT-TH_BD2.0-D1.0]  143.09 18.29 0 top
U19  P70-2200045  [TESTPOINT-TH_BD2.0-D1.0_TESTPOINT-TH_BD2.0-D1.0]  143.51 44.23 0 top
U20  P70-2200045  [TESTPOINT-TH_BD2.0-D1.0_TESTPOINT-TH_BD2.0-D1.0]  143.08 25.01 0 top
U21  P70-2200045  [TESTPOINT-TH_BD2.0-D1.0_TESTPOINT-TH_BD2.0-D1.0]  19.38 57.66 0 top
U22  P70-2200045  [TESTPOINT-TH_BD2.0-D1.0_TESTPOINT-TH_BD2.0-D1.0]  22.61 57.69 0 top

## Footprints (pads in the part's own frame, mm; a bottom-side part is the same pattern mirrored in y, then rotated)
C0603
  rect 0.8x0.9 smd: 1(-0.7,0) 2(0.7,0)
Pad_e47
  round 2.032 hole 2.032: 1(0,0)
Pad_e51
  round 2.032 hole 2.032: 1(0,0)
Pad_e53
  round 2.032 hole 2.032: 1(0,0)
Pad_e56
  round 2.032 hole 147x2.032: 1(0,0)
PWRM-TH_OKI-78SR-3.3-1.5-W36-C
  rect 1.7x1.7 hole 1.1: 1(-2.5,0)
  round 1.7 hole 1.1: 2(0,0) 3(2.5,0)
PWRM-TH_RW2-XXXXX
  rect 1.6x1.6 hole 1: 1(-8.89,-8.5)
  round 1.6 hole 1: 7(6.35,-8.5) 8(8.89,-8.5) 9(8.89,8.5) 10(6.35,8.5) 16(-8.89,8.5)
R0603
  rect 0.806x0.864 smd: 1(-0.753,0) 2(0.753,0)
RASPBERRY PI PICO/ RASPBERRY PI PICO W
  round 1.6 hole 1: 1(1.61,49.63) 2(1.61,47.09) 4(1.61,42.01) 5(1.61,39.47) 6(1.61,36.93) 7(1.61,34.39) 9(1.61,29.31) 10(1.61,26.77) 11(1.61,24.23) 12(1.61,21.69) 14(1.61,16.61) 15(1.61,14.07) 16(1.61,11.53) 17(1.61,8.99) 19(1.61,3.91) 20(1.61,1.37) 21(19.39,1.37) 22(19.39,3.91) 24(19.39,8.99) 25(19.39,11.53) 26(19.39,14.07) 27(19.39,16.61) 29(19.39,21.69) 30(19.39,24.23) 31(19.39,26.77) 32(19.39,29.31) 34(19.39,34.39) 35(19.39,36.93) 36(19.39,39.47) 37(19.39,42.01) 39(19.39,47.09) 40(19.39,49.63)
  rect 1.6x1.6 hole 1: 3(1.61,44.55) 8(1.61,31.85) 13(1.61,19.15) 18(1.61,6.45) 23(19.39,6.45) 28(19.39,19.15) 33(19.39,31.85) 38(19.39,44.55)
SOIC-8_L4.9-W3.9-P1.27-LS6.0-BL
  oval 0.588x2.045 smd: 1(-1.905,-2.57) 2(-0.635,-2.57) 3(0.635,-2.57) 4(1.905,-2.57) 5(1.905,2.57) 6(0.635,2.57) 7(-0.635,2.57) 8(-1.905,2.57)
SOIC-14_L8.7-W3.9-P1.27-LS6.0-BL
  oval 0.574x2.038 smd: 1(-3.81,-2.619) 2(-2.54,-2.619) 3(-1.27,-2.619) 4(0,-2.619) 5(1.27,-2.619) 6(2.54,-2.619) 7(3.81,-2.619) 8(3.81,2.619) 9(2.54,2.619) 10(1.27,2.619) 11(0,2.619) 12(-1.27,2.619) 13(-2.54,2.619) 14(-3.81,2.619)
SOIC-16_L10.3-W7.4-P1.27-LS10.3-BL
  oval 0.574x2.401 smd: 1(-4.445,-4.75) 2(-3.175,-4.75) 3(-1.905,-4.75) 4(-0.635,-4.75) 5(0.635,-4.75) 6(1.905,-4.75) 7(3.175,-4.75) 8(4.445,-4.75) 9(4.445,4.75) 10(3.175,4.75) 11(1.905,4.75) 12(0.635,4.75) 13(-0.635,4.75) 14(-1.905,4.75) 15(-3.175,4.75) 16(-4.445,4.75)
SOIC-16_L10.3-W7.5-P1.27-LS10.3-BL
  oval 0.574x2.401 smd: 1(-4.445,-4.75) 2(-3.175,-4.75) 3(-1.905,-4.75) 4(-0.635,-4.75) 5(0.635,-4.75) 6(1.905,-4.75) 7(3.175,-4.75) 8(4.445,-4.75) 9(4.445,4.75) 10(3.175,4.75) 11(1.905,4.75) 12(0.635,4.75) 13(-0.635,4.75) 14(-1.905,4.75) 15(-3.175,4.75) 16(-4.445,4.75)
TESTPOINT-TH_BD2.0-D1.0_TESTPOINT-TH_BD2.0-D1.0
  round 1.8 hole 1.2: 1(0,0)

## Nets
As in the schematic.

Pads without a net: DAC1 2 6 7 10; DAC2 2 6 7 10; DIG-ISO2 6 11; DIG-ISO3 6 11; NOREF 1; NOREF#2 1; NOREF#3 1; NOREF#4 1; U2 1 5 7; U3 1 5 7; U7 1 5 7; U8 1 5 8; U11 3 5 11 12 14; U13 7 8; U14 7 8; U15 1 2 3 4 5 6 7 8 9 10 11 12 13 14 18 19 20 21 23 26 27 28 29 30 31 32 33 34 35 37 39 40; U16 3 11 12 14

## Via types
v1: diameter 0.61, hole 0.305, Top Layer to Bottom Layer, 53 vias

## Routing (per net, layer and track width the routed paths; a pad name or vN(x,y) marks a point on that pad's centre or on a via; arc(x,y) is an arc through that point)
+3.3V-ISO1: length 107.5
  Top Layer w0.254: C7.2 55.06,21.63 74.93,21.63 74.93,16.55 89.92,16.55 v1(89.92,31.02) ; 103.89,37.12 103.89,39.66 100.58,39.66 100.58,38.84 C6.1 98.04,38.77 91.69,38.77 91.69,31.02 93.65,31.02 v1(93.65,31.15) 100.08,31.15 100.08,32.04 DAC1.13 104.93,32.04 104.93,30.77 DAC1.1 ; 103.89,37.12 DAC1.9 ; 103.89,37.12 103.89,34.58 DAC1.11
  Bottom Layer w0.254: v1(89.92,31.02) 93.65,31.02 v1(93.65,31.15)
+30V: length 194.8
  Top Layer w0.254: U14.9 29.01,47.4 U1.1 ; v1(130.3,43.72) 140.59,43.72 v1(140.59,35.88)
  Bottom Layer w0.254: U1.1 35.62,65.31 140.84,65.31 v1(140.84,55.69) v1(128.65,55.69) 125.98,55.69 125.98,43.72 v1(130.3,43.72) 130.3,36.13 v1(130.43,36.13)
-30V: length 177
  Top Layer w0.254: U13.10 30.85,16.55 U9.1
  Bottom Layer w0.254: U9.1 132.97,16.55 v1(132.97,30.99) 132.59,30.99 132.59,48.55 ; v1(132.46,50.55) 132.59,50.55 132.59,48.55 ; 132.59,48.55 144.65,48.55 v1(144.65,50.55) ; 132.97,28.64 144.4,28.64 v1(144.4,30.74)
GND: length 138.9
  Top Layer w0.254: U10.1 24.38,27.84 U13.9 28.63,25.55 C5.2 29.27,29.75 24.95,34.07 24.13,34.07 U14.10 33.92,57.19 76.71,57.19 76.71,58.22 U15.38 78.99,58.3 78.99,59.73 83.9,59.73 v1(83.9,59.85) ; 84.15,52.23 84.15,40.42 85.83,40.42 85.83,37.4 ; 84.4,37.5 84.4,37.4 85.83,37.4 ; 84.4,29.88 85.83,29.88 85.83,37.4
  Bottom Layer w0.254: v1(83.9,59.85) v1(83.9,52.23)
GND-ISO1: length 167.4
  Top Layer w0.254: U11.15 40.89,25.74 40.89,23.66 41.15,23.4 48.01,23.4 48.64,24.04 U11.9 53.53,25.87 ; U11.13 43.56,23.4 ; 53.53,25.87 v1(53.53,30.52) ; 53.53,25.87 53.53,23.66 C7.1 ; v1(90.93,37.37) 90.93,29.88 DIG-ISO2.9 ; v1(93.65,37.5) 98.04,37.5 C6.2 100.49,37.44 ; 100.49,37.44 100.49,33.31 DAC1.12 ; 100.49,37.44 101.09,38.39 v1(102.28,38.39) ; v1(102.28,41.67) 113.54,41.67 113.54,50.58 120.36,50.58 ; 113.54,45.25 141.99,45.25 141.99,39.37 U4.1
  Bottom Layer w0.254: 53.53,29.25 72.9,29.25 72.9,36.87 90.93,36.87 ; 53.53,29.24 v1(53.53,30.52) ; v1(93.65,37.5) v1(90.93,37.37) 90.93,36.84 ; v1(102.28,41.67) v1(102.28,38.39)
GND-ISO2: length 173.9
  Top Layer w0.254: U16.15 41.02,43.6 41.4,43.22 48.77,43.22 48.77,45.05 U16.9 48.71,45.24 v1(48.71,52.11) ; U16.13 43.56,43.22 ; v1(93.4,52.23) 91.19,52.23 91.19,59.85 DIG-ISO3.15 ; 93.47,52.23 96.77,52.23 C8.1 107.52,51.91 DAC2.8 ; DAC2.12 105.92,58.2 105.92,53.12 DAC2.8 ; DAC2.8 109.98,53.12 v1(109.98,44.23) ; v1(116.84,44.23) 116.84,40.42 120.36,40.42 ; R7.1 v1(120.4,29.42) ; v1(120.4,25.14) 120.4,18.29 U18.1 143.09,18.07
  Bottom Layer w0.254: v1(48.71,52.11) 81.28,52.11 81.28,51.09 93.47,51.09 93.47,52.23 v1(93.4,52.23) ; v1(109.98,44.23) v1(116.84,44.23) ; v1(120.4,29.42) v1(120.4,25.14)
+3.3(PICO): length 316
  Top Layer w0.254: U12.3 14.95,58.2 1.78,58.2 1.78,6.64 38.25,6.64 38.25,16.37 ; C5.1 C9.1 30.67,32.29 v1(36.32,32.29) 38.22,32.29 ; 38.25,16.37 38.25,35.67 U16.1 39.8,35.62 39.8,33.6 44.2,33.6 44.2,35.04 U16.5 v1(47.37,35.67) ; 38.25,16.37 U11.1 ; 39.78,16.23 39.69,16.14 C1.2 ; 39.69,12.53 46.94,12.53 U5.1 47.24,16.24 U11.7 ; U11.6 47.24,16.37 47.31,16.3 ; v1(52.83,35.67) 56.64,35.67 56.64,51.85 76.79,51.85 U15.36 ; v1(64.26,32.29) 75.18,32.29 75.18,34.07 82.13,34.07 ; 82.13,38.77 82.13,53.49 83.9,53.49 ; 82.13,38.77 84.15,38.77 ; 82.13,38.77 82.13,31.15 DIG-ISO2.7 ; 83.9,61.12 85.6,61.12 85.6,53.5 DIG-ISO3.7
  Bottom Layer w0.254: v1(36.32,32.29) 57.15,32.29 57.15,31.53 64.26,31.53 v1(64.26,32.29) ; v1(52.83,35.67) v1(47.37,35.67)
BATTERY+: length 47.5
  Top Layer w0.254: U13.16 6.6,45.11 U14.16 8.89,55.11 U12.1 ; v1(19.35,51.89) 19.35,56.84
  Bottom Layer w0.254: 8.89,51.92 v1(8.89,51.89) v1(19.35,51.89)
BATTERY-: length 178.5
  Top Layer w0.254: U13.1 6.6,19.74 8.89,22.02 8.89,42.45 12.45,46 U12.2 ; 8.89,30.38 8.89,28.72 ; v1(22.61,50.07) 22.61,56.9 ; v1(41.02,35.67) 41.02,37.25 41.66,37.88 47.75,37.88 48.64,36.99 U16.8 48.64,30.01 38.97,30.01 38.97,23.71 40.56,22.82 41.7,18.57 ; U11.2 41.7,17.04 41.7,18.57 ; C2.1 C1.1 48.69,8.93 48.69,16.32 U11.8 ; 41.7,18.57 43.56,18.57 ; 43.56,18.57 48.51,18.57 48.51,16.32 ; 43.56,18.57 U11.4 ; U16.4 43.56,37.88
  Bottom Layer w0.254: v1(41.02,35.67) 8.89,35.67 U14.1 ; v1(22.61,50.07) 12.37,50.07
  vias: v1(12.37,49.96)
CHANNEL_2_OUT+: length 13.4
  Top Layer w0.254: v1(143.13,30.74) 143.13,25.54
  Bottom Layer w0.254: v1(137.19,33.06) 143.13,33.06 v1(143.13,30.74)
$1N2: length 10.4
  Top Layer w0.254: v1(142.11,50.55) 142.11,46.52
  Bottom Layer w0.254: v1(142.11,50.55) 142.11,53.88 143.26,53.88 143.26,55.69 v1(143.38,55.69)
$1N1782: length 14.8
  Top Layer w0.254: DIG-ISO2.13 v1(97.76,34.96)
  Bottom Layer w0.254: v1(97.76,34.96) 104.93,34.96 104.93,35.85 v1(107.52,35.85)
$1N1783: length 17
  Top Layer w0.254: U15.25 80.52,25.28 v1(80.52,32.29)
  Bottom Layer w0.254: v1(80.52,32.29) 80.52,34.96 v1(84.15,34.96)
$1N1784: length 16.5
  Top Layer w0.254: DIG-ISO2.14 93.65,36.1 v1(96.52,36.1)
  Bottom Layer w0.254: v1(96.52,36.1) 96.52,34.07 107.44,34.07 107.44,34.58 v1(107.52,34.58)
$1N1785: length 24.1
  Top Layer w0.254: U15.24 75.18,22.74 75.18,31.53 79.5,31.53 v1(79.5,33.06)
  Bottom Layer w0.254: v1(79.5,33.06) 79.5,36.23 v1(84.15,36.23)
$1N1786: length 15.3
  Bottom Layer w0.254: v1(93.65,33.69) 95.25,33.69 95.25,32.8 107.52,32.8 v1(107.52,33.31)
$1N1787: length 23.4
  Top Layer w0.254: U15.22 81.42,17.66 v1(81.42,31.15)
  Bottom Layer w0.254: v1(81.42,31.15) 81.42,33.69 v1(84.15,33.69)
$1N1797: length 48.1
  Top Layer w0.254: v1(93.4,53.5) 93.4,53.31 C10.1 100.58,53.31 100.58,52.36 104.65,52.36 104.65,59.43 ; DAC2.1 104.65,60.74 104.65,59.43 ; 104.65,59.43 107.52,59.43 v1(107.52,59.47) ; v1(107.52,56.93) 108.97,56.93 108.97,54.39 DAC2.9
  Bottom Layer w0.254: v1(93.4,53.5) 90.17,53.5 90.17,61.12 v1(93.4,61.12) ; v1(107.52,59.47) v1(107.52,56.93)
+3.3-ISO1: length 23
  Top Layer w0.254: U11.16 39.8,25.87 39.8,27.72 47.24,27.72 ; 47.24,27.72 47.37,27.59 U11.10 ; 47.24,27.72 47.5,27.47 C4.2 C3.2 ; U17.1 52.13,34.07 52.13,30.7
+3.3-ISO2: length 23.3
  Top Layer w0.254: U16.16 39.75,46.14 40.89,47.28 46.23,47.28 47.37,46.14 U16.10 47.37,49.75 C11.2 C12.2 47.31,54.16 U6.1
CH1-INPUT: length 31.3
  Top Layer w0.254: DAC1.14 102.28,27.21 R9.1
CHANNEL_1_OUT+: length 14.2
  Top Layer w0.254: R-SENSE1.1 143.38,52.88 143.38,44.68
$1N1: length 13.4
  Top Layer w0.254: R1.2 140.43,46.52 ; U3.3 131.19,46.52
$1N5: length 19.2
  Top Layer w0.254: R5.1 121.93,50.58 ; 121.95,50.58 121.95,48.91 129.92,48.91 129.92,50.55
$1N7: length 18.2
  Top Layer w0.254: 123.48,58.46 131.15,58.46 131.15,55.69 U3.6 131.19,52.77 135.89,52.77 135.89,52.87
$1N9: length 12.1
  Top Layer w0.254: 130.84,40.42 130.84,37.79 131.7,37.79 131.7,33.31 135.6,33.31 135.6,33.06
$1N11: length 22.4
  Top Layer w0.254: 127.76,40.42 R7.2 ; 127.76,40.42 129.25,40.42 ; 127.76,40.42 127.76,29.5 130.43,29.5 U8.2
$1N13: length 9.9
  Top Layer w0.254: 141.86,27.21 U7.2 141.86,33.56 143,33.56 143,35.88 U7.6
$1N14: length 12.5
  Top Layer w0.254: 131.6,27.21 140.18,27.21 ; 131.7,30.99 131.7,27.21 131.57,27.21
$1N1790: length 63.2
  Top Layer w0.2: U15.16 56.64,25.28 56.64,31.79 60.2,31.79 60.2,49.57 78.99,49.57 78.99,57.44 80.77,57.44 80.77,58.71 83.9,58.71 DIG-ISO3.3
$1N1791: length 64.5
  Top Layer w0.2: U15.17 60.2,22.74 60.2,26.45 57.66,26.45 57.66,29.25 61.47,29.25 61.47,46.85 79.76,46.85 79.76,56.42 81.79,56.42 81.79,57.19 83.9,57.19 DIG-ISO3.4
$1N1792: length 10.5
  Top Layer w0.254: DIG-ISO3.14 97.74,58.58 97.74,56.93 DAC2.4
$1N1793: length 14.5
  Top Layer w0.254: DIG-ISO3.13 91.69,57.31 91.69,55.41 102.28,55.41 DAC2.5
$1N1794: length 13.5
  Top Layer w0.254: 93.65,56.04 93.65,56.31 103.76,56.31 103.76,58.2 102.54,58.2
$1N1795: length 53.1
  Top Layer w0.254: U15.15 62.48,27.82 62.48,44.23 80.26,44.23 80.26,55.66 82.3,55.66 82.3,56.04 83.9,56.04

## Text on the board
Top Layer: -30V | +30v | +3.3V-ISO2 | +3.3V(PICO) | +3.3V-ISO1 | Ch1-GND | Ch2-Out | Ch2-GND | Ch1-Out | Aadhi, Aaron, Jack, Ben | ECE455 Spring 2026 Brain Temporal Stimulator
